# Altium project 移相器PCB_Project.PrjPcb
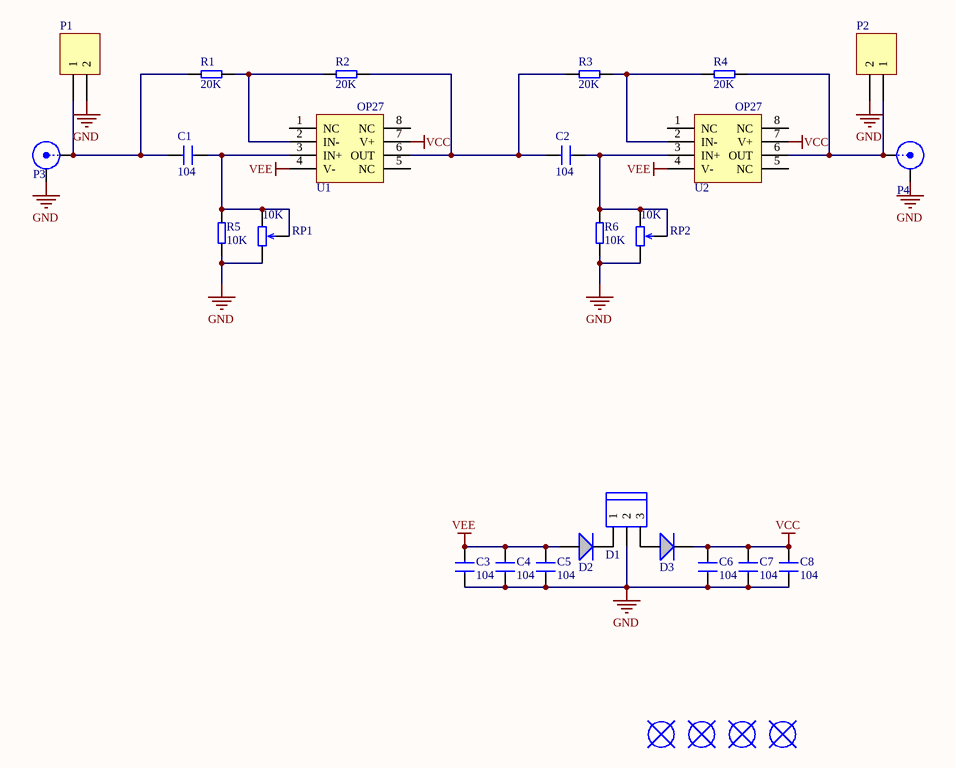
[diagram p0: 移相器Sheet1.SchDoc]
1 sheet, 29 parts. Net scope: global (net labels, ports and power ports of the same name join across sheets).
Board file: 移相器PCB1.PcbDoc

## Sheet 移相器Sheet1.SchDoc
size A4

### Parts
C1  104  [电容0805]
C2  104  [电容0805]
C3  104  [电容0805]
C4  104  [电容0805]
C5  104  [电容0805]
C6  104  [电容0805]
C7  104  [电容0805]
C8  104  [电容0805]
D1  接线端子  [CONN-TH_XH2.54-3P]  (value not drawn)
D2  1N4150  [DIOMELF3414N]  (value not drawn)
D3  1N4150  [DIOMELF3414N]  (value not drawn)
G1  定位孔  [定位孔]  (value not drawn)
G2  定位孔  [定位孔]  (value not drawn)
G3  定位孔  [定位孔]  (value not drawn)
G4  定位孔  [定位孔]  (value not drawn)
P1  Header 2  [HDR1X2]  (value not drawn)
P2  Header 2  [HDR1X2]  (value not drawn)
P3  SMB  [BWSMA-KE-P001]  (value not drawn)
P4  SMB  [BWSMA-KE-P001]  (value not drawn)
R1  20K  [电阻0805]
R2  20K  [电阻0805]
R3  20K  [电阻0805]
R4  20K  [电阻0805]
R5  10K  [0805（两个串联式）]
R6  10K  [0805（两个串联式）]
RP1  10K  [电位器]
RP2  10K  [电位器]
U1  OP27  [SOIC-8]
U2  OP27  [SOIC-8]

### Nets
GND: C3.1 C4.1 C5.1 C6.2 C7.2 C8.1 D1.2 P1.2 P2.2 P3.2(Y) P4.2(Y) R5.2 R6.2 RP1.3 RP2.3
VCC: C6.1 C7.1 C8.2 D3.2 U1.7(V+) U2.7(V+)
VEE: C3.2 C4.2 C5.2 D2.1 U1.4(V-) U2.4(V-)
NetC1_1: C1.1 R5.1 RP1.1 RP1.2 U1.3(IN+)
NetC1_2: C1.2 P1.1 P3.1(X) R1.2
NetC2_1: C2.1 R6.1 RP2.1 RP2.2 U2.3(IN+)
NetC2_2: C2.2 R2.1 R3.2 U1.6(OUT)
NetD1_1: D1.1 D2.2
NetD1_3: D1.3 D3.1
NetP2_1: P2.1 P4.1(X) R4.1 U2.6(OUT)
NetR1_1: R1.1 R2.2 U1.2(IN-)
NetR3_1: R3.1 R4.2 U2.2(IN-)

Not connected (* = marked no-connect by the designer): U1 1(NC) 5(NC) 8(NC); U2 1(NC) 5(NC) 8(NC)

### Library data of the parts
C1-C8 = 无极性电容
D1 = 3P接线端子
P1 P2 = Header 2: Header, 2-Pin; LatestRevisionDate: 17-Jul-2002; LatestRevisionNote: Re-released for DXP Platform.; Publisher: Altium Limited
P3 P4 = 天线座: SMB Straight Connector; LatestRevisionDate: 17-Jul-2002; LatestRevisionNote: Re-released for DXP Platform.; Publisher: Altium Limited
R1-R6 = 电阻
RP1 RP2 = 电位器
U1 U2 = OPA695